# EAGLE design Ethernet Adapter (EAGLE 8.6.0)
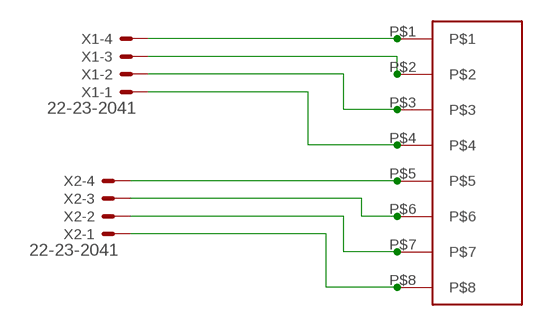
[diagram p0: schematic, sheet 1]

## Parts
U$1  ETHERNETPORT  [ETHERNETPORT]
X1  22-23-2041  [22-23-2041]
X2  22-23-2041  [22-23-2041]

## Nets
N$1: U$1.P$1 X1.4
N$2: U$1.P$2 X1.3
N$3: U$1.P$3 X1.2
N$4: U$1.P$4 X1.1
N$5: U$1.P$5 X2.4
N$6: U$1.P$6 X2.3
N$7: U$1.P$7 X2.2
N$8: U$1.P$8 X2.1

## Library data of the parts
U$1 = ETHERNETPORT:ETHERNETPORT: Digikey Part Number 380-1046-ND
X1 X2 = con-molex:22-23-2041: .100" (2.54mm) Center Header - 4 Pin; MF: MOLEX; MPN: 22-23-2041; OC_FARNELL: 1462920; OC_NEWARK: 38C0355

## Net classes
0 default: width 0.254 mm, drill 0.254 mm, clearance 0.254 mm

## Board
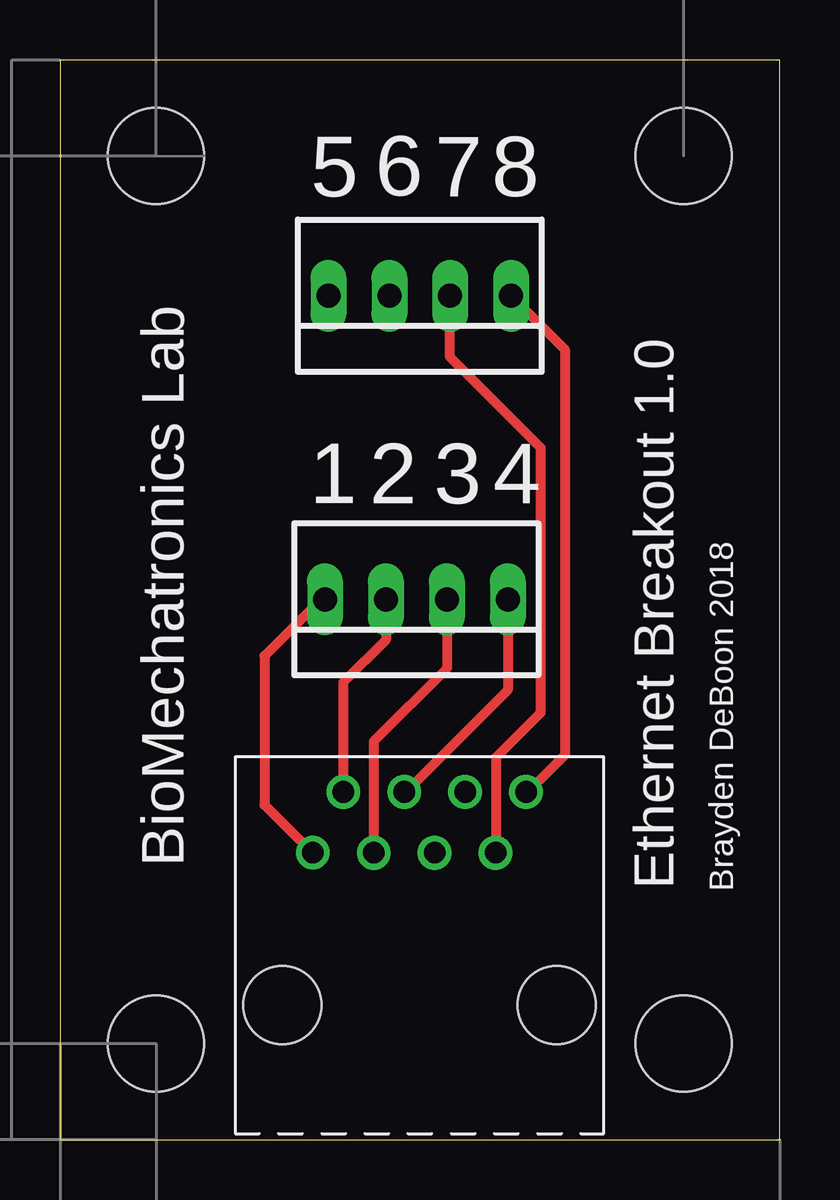
[diagram p1: board, top side]
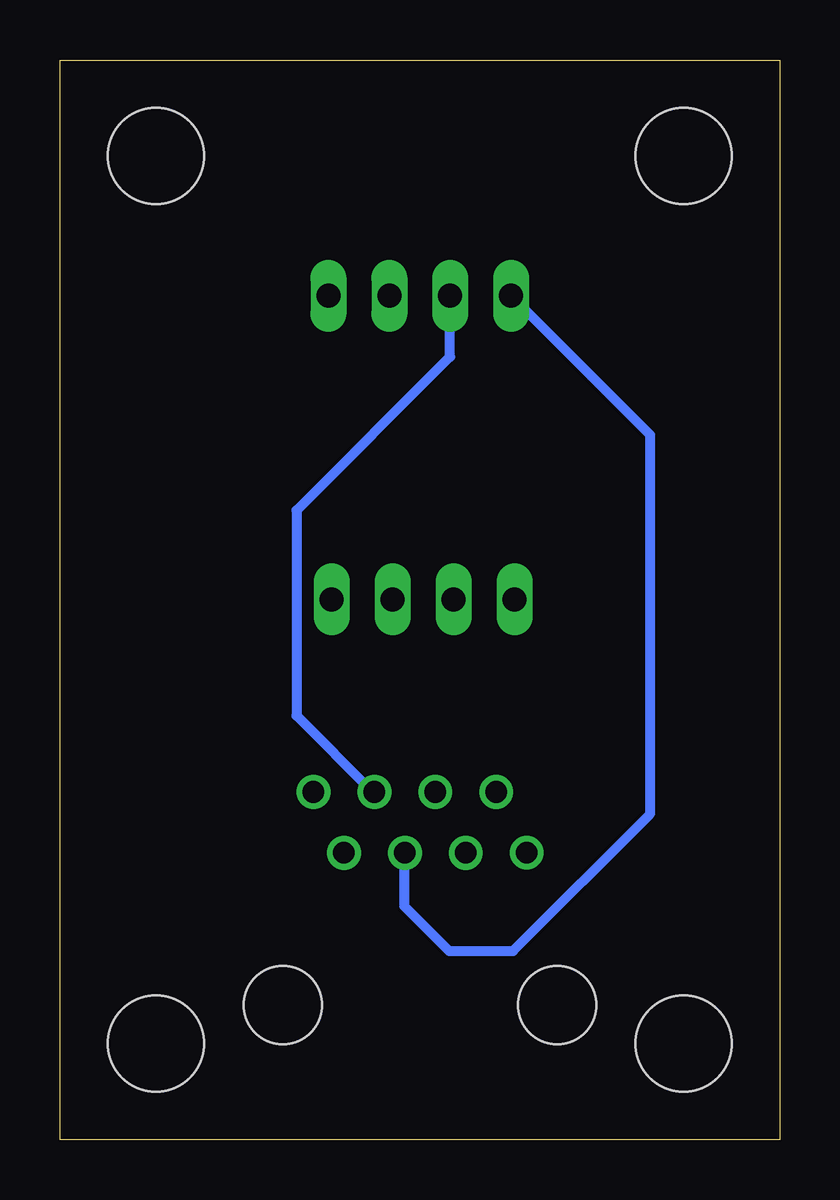
[diagram p2: board, bottom side, seen from below]

Size 30 x 45 mm. Coordinates in mm from the lower left corner, seen from the top.
Outline: 0,0 30,0 30,45 0,45 0,0
Copper layers (1*16): Top 0.035mm / dielectric 1.5mm / Bottom 0.035mm
Design rules "default *": minimum track width 6mil, minimum drill 0.35mm, track to track 8mil, track to pad 8mil, pad to pad 8mil, via to via 8mil, smd to smd 8mil, copper to edge 40mil, drill to drill 6mil, minimum pad ring 10mil, minimum via ring 8mil, stop-mask expansion 4mil, vias tented up to drill 0mil, thermal gap 10mil
Holes 4 mm at 4,4 26,4 26,41 4,41

### Footprints (pad centres in the part's own frame; a part is rotated, then mirrored left to right if it is on the bottom)
ETHERNETPORT = drill 0.9: P$1 -4.45,6.36; P$2 -3.18,8.89; P$3 -1.91,6.35; P$4 -0.64,8.89; P$5 0.63,6.35; P$6 1.9,8.89; P$7 3.17,6.35; P$8 4.44,8.89 | hole 3.25: 5.72,0; -5.72,0
22-23-2041 = drill 1 long: 1 -3.81,0; 2 -1.27,0; 3 1.27,0; 4 3.81,0

### Placement (x,y rotation side)
U$1  14.99,5.6 0 top
X1  14.86,22.52 180 top
X2  15,35.17 180 top

### Tracks (layer width: path | path; a pad name or v marks a point on that pad's centre or on a via)
N$1
  Top 0.406: X1.4 10.89,22.52 8.53,20.16 8.53,13.94 10.51,11.96 U$1.P$1
N$2
  Top 0.406: X1.3 13.59,20.83 11.81,19.05 U$1.P$2
N$3
  Top 0.406: X1.2 16.13,19.64 13.08,16.59 U$1.P$3
N$4
  Top 0.406: X1.1 18.67,18.74 14.42,14.49 U$1.P$4
N$5
  Bottom 0.406: X2.4 5.39,29.37 5.39,13.58 11.11,7.86 13.78,7.86 15.64,9.72 15.64,11.93 U$1.P$5
N$6
  Bottom 0.406: X2.3 13.73,32.63 20.14,26.22 20.14,17.67 16.96,14.49 U$1.P$6
N$7
  Top 0.406: X2.2 16.27,32.61 20.05,28.83 20.05,17.8 18.18,15.93 18.18,11.97 U$1.P$7
N$8
  Top 0.406: X2.1 21.05,32.93 21.05,16.04 19.5,14.49 U$1.P$8

### Text on the board
tPlace: 5 | 6 | 7 | 8 | 1 | 2 | 3 | 4 | BioMechatronics Lab | Brayden DeBoon 2018 | Ethernet Breakout 1.0